# Altium schematic sheet Power.SchDoc
size A4
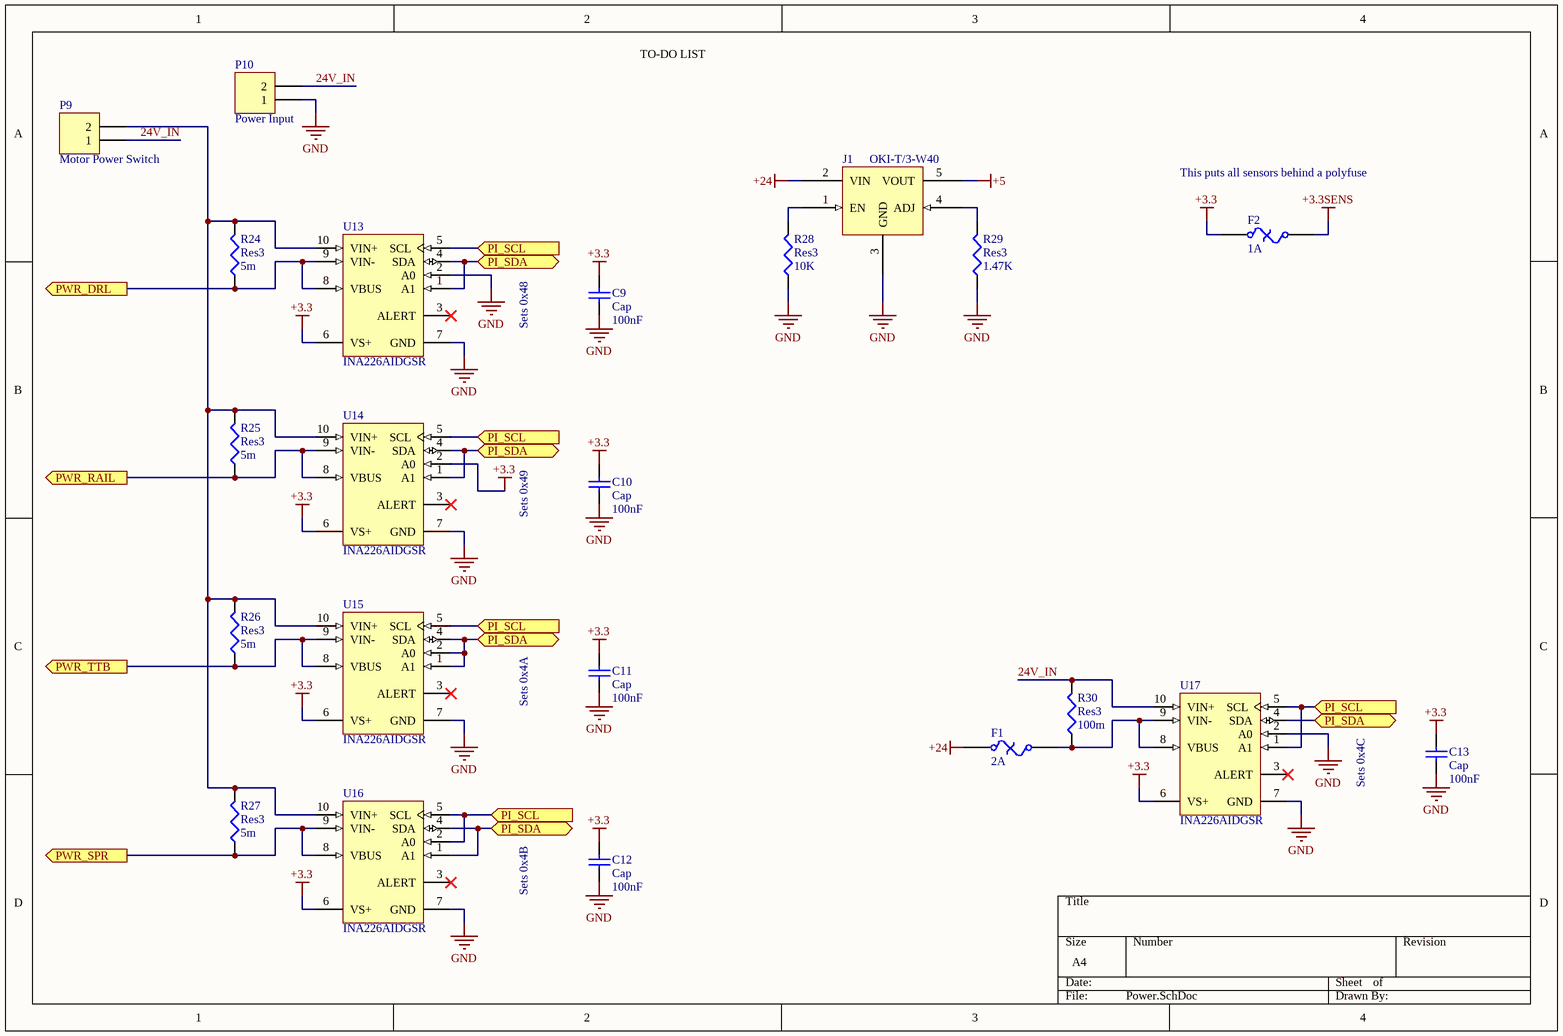
[diagram p0: Power.SchDoc]

## Parts
C9  Cap  value 100nF  [C0805]
C10  Cap  value 100nF  [C0805]
C11  Cap  value 100nF  [C0805]
C12  Cap  value 100nF  [C0805]
C13  Cap  value 100nF  [C0805]
F1  2A  [2920]
F2  1A  [2920]
J1  OKI-T/3-W40  [OKI-T/3-W40]
P9  Motor Power Switch  [SuperSabre-2pos]
P10  Power Input  [SuperSabre-2pos]
R24  Res3  value 5m  [FCSL110]
R25  Res3  value 5m  [FCSL110]
R26  Res3  value 5m  [FCSL110]
R27  Res3  value 5m  [FCSL110]
R28  Res3  value 10K  [C0805]
R29  Res3  value 1.47K  [C0805]
R30  Res3  value 100m  [RW5S0]
U13  INA226AIDGSR  [DGS0010A_L]
U14  INA226AIDGSR  [DGS0010A_L]
U15  INA226AIDGSR  [DGS0010A_L]
U16  INA226AIDGSR  [DGS0010A_L]
U17  INA226AIDGSR  [DGS0010A_L]

## Ports
PI_SCL (in), PI_SDA (bidir), PWR_DRL (out), PWR_RAIL (out), PWR_SPR (out), PWR_TTB (out)

## Nets
+3.3: C9.2 C10.2 C11.2 C12.2 C13.2 F2.1 U13.6(VS+) U14.2(A0) U14.6(VS+) U15.6(VS+) U16.6(VS+) U17.6(VS+)
+3.3SENS: F2.2
+5: J1.5(VOUT)
+24: F1.1 J1.2(VIN)
GND: C9.1 C10.1 C11.1 C12.1 C13.1 J1.3(GND) P10.1 R28.1 R29.1 U13.2(A0) U13.7(GND) U14.7(GND) U15.7(GND) U16.7(GND) U17.2(A0) U17.7(GND)
24V_IN: P9.1 P10.2 R30.2 U17.10(VIN+)
PI_SCL: U13.5(SCL) U14.5(SCL) U15.5(SCL) U16.2(A0) U16.5(SCL) U17.1(A1) U17.5(SCL) ; port PI_SCL
PI_SDA: U13.1(A1) U13.4(SDA) U14.1(A1) U14.4(SDA) U15.1(A1) U15.2(A0) U15.4(SDA) U16.1(A1) U16.4(SDA) U17.4(SDA) ; port PI_SDA
PWR_DRL: R24.1 U13.8(VBUS) U13.9(VIN-) ; port PWR_DRL
PWR_RAIL: R25.1 U14.8(VBUS) U14.9(VIN-) ; port PWR_RAIL
PWR_SPR: R27.1 U16.8(VBUS) U16.9(VIN-) ; port PWR_SPR
PWR_TTB: R26.1 U15.8(VBUS) U15.9(VIN-) ; port PWR_TTB
NetF1_2: F1.2 R30.1 U17.8(VBUS) U17.9(VIN-)
NetJ1_1: J1.1(EN) R28.2
NetJ1_4: J1.4(ADJ) R29.2
NetP9_2: P9.2 R24.2 R25.2 R26.2 R27.2 U13.10(VIN+) U14.10(VIN+) U15.10(VIN+) U16.10(VIN+)

Not connected (* = marked no-connect by the designer): U13 3(ALERT)*; U14 3(ALERT)*; U15 3(ALERT)*; U16 3(ALERT)*; U17 3(ALERT)*

## Notes on the sheet
- (near J1) TO-DO LIST
- This puts all sensors behind a polyfuse
- Sets 0x48
- Sets 0x49
- Sets 0x4A
- Sets 0x4C
- Sets 0x4B

## Library data of the parts
C9-C13 = Cap: Capacitor; Published: 8-Jun-2000; LatestRevisionDate: 17-Jul-2002; LatestRevisionNote: Re-released for DXP Platform.; PackageReference: RAD-0.3; Publisher: Altium Limited; PackageDescription: Radial Cap, Thru-Hole; 2 Leads; 0.3 in Pin Spacing
F1 F2 = Fuse Thermal: Thermal Fuse; Published: 24-Mar-1999; LatestRevisionDate: 17-Jul-2002; LatestRevisionNote: Re-released for DXP Platform.; PackageReference: PIN-W2/E2.8; Publisher: Altium Limited; PackageDescription: Thru-Hole; 2 Leads
J1 = OKI-T/3-W40: Adjustable Output 3-Amp DOSA-SMT DC/DC Converters; ComponentLink1Description: Datasheet; ComponentLink1URL: https://power.murata.com/data/power/oki-t3-w40.pdf
P9 P10 = Header 2: Header, 2-Pin; LatestRevisionDate: 17-Jul-2002; LatestRevisionNote: Re-released for DXP Platform.; Publisher: Altium Limited
R24-R30 = Res3: Resistor; Published: 8-Jun-2000; LatestRevisionDate: 29-May-2009; LatestRevisionNote: IPC-7351 Footprint Added.; PackageReference: J1-0603; Publisher: Altium Limited; PackageDescription: Chip Resistor
U13-U17 = CMP-0704-00058-2: High-Side Measurement, Bi-Directional Current / Power Monitor with I2C Interface, 2.7 to 5.5 V, -40 to 125 degC, 10-pin SOP (DGS10), Green (RoHS & no Sb/Br); Vs(Max)(V): 5.5; CMRR(Min)(dB): 126; Rating: Catalog; Input Offset (+/-)(Max)(uV): 10; Small-Signal Bandwidth(Typ)(MHz): 0.007; Input Offset Drift (+/-)(Max)(uV/Degrees Celsius): 0.1; Common Mode Range(Max)(V): 36; Gain(V/V): 1; SubFamily: Current Shunt Monitor; Quiescent Current (+/-)(Typ)(mA): 0.33; Vs(Min)(V): 2.7; Common Mode Range(Min)(V): 0; ComponentLink2URL: http://www.ti.com/general/docs/lit/getliterature.tsp?genericPartNumber=INA226&fileType=pdf; ComponentLink1URL: http://www.ti.com/; PartNumber: INA226AIDGSR; Mounting Technology: Surface Mount; PackageDescription: 10-Pin Plastic Small Outline, Body 3 x 3 mm, Pitch 0.5 mm; ComponentLink3Description: Package Specification; Code_JEDEC: MO-153; Eco-Plan: Green (RoHS & no Sb/Br); PackageReference: DGS0010A; ComponentLink2Description: Datasheet; ComponentLink3URL: http://www.ti.com/lit/ml/mpds035b/mpds035b.pdf; ComponentLink1Description: Manufacturer URL; DatasheetVersion: SBOS547; PackageVersion: 4073272/C, 02/2004